# Altium project MSD_FINAL.PrjPcb
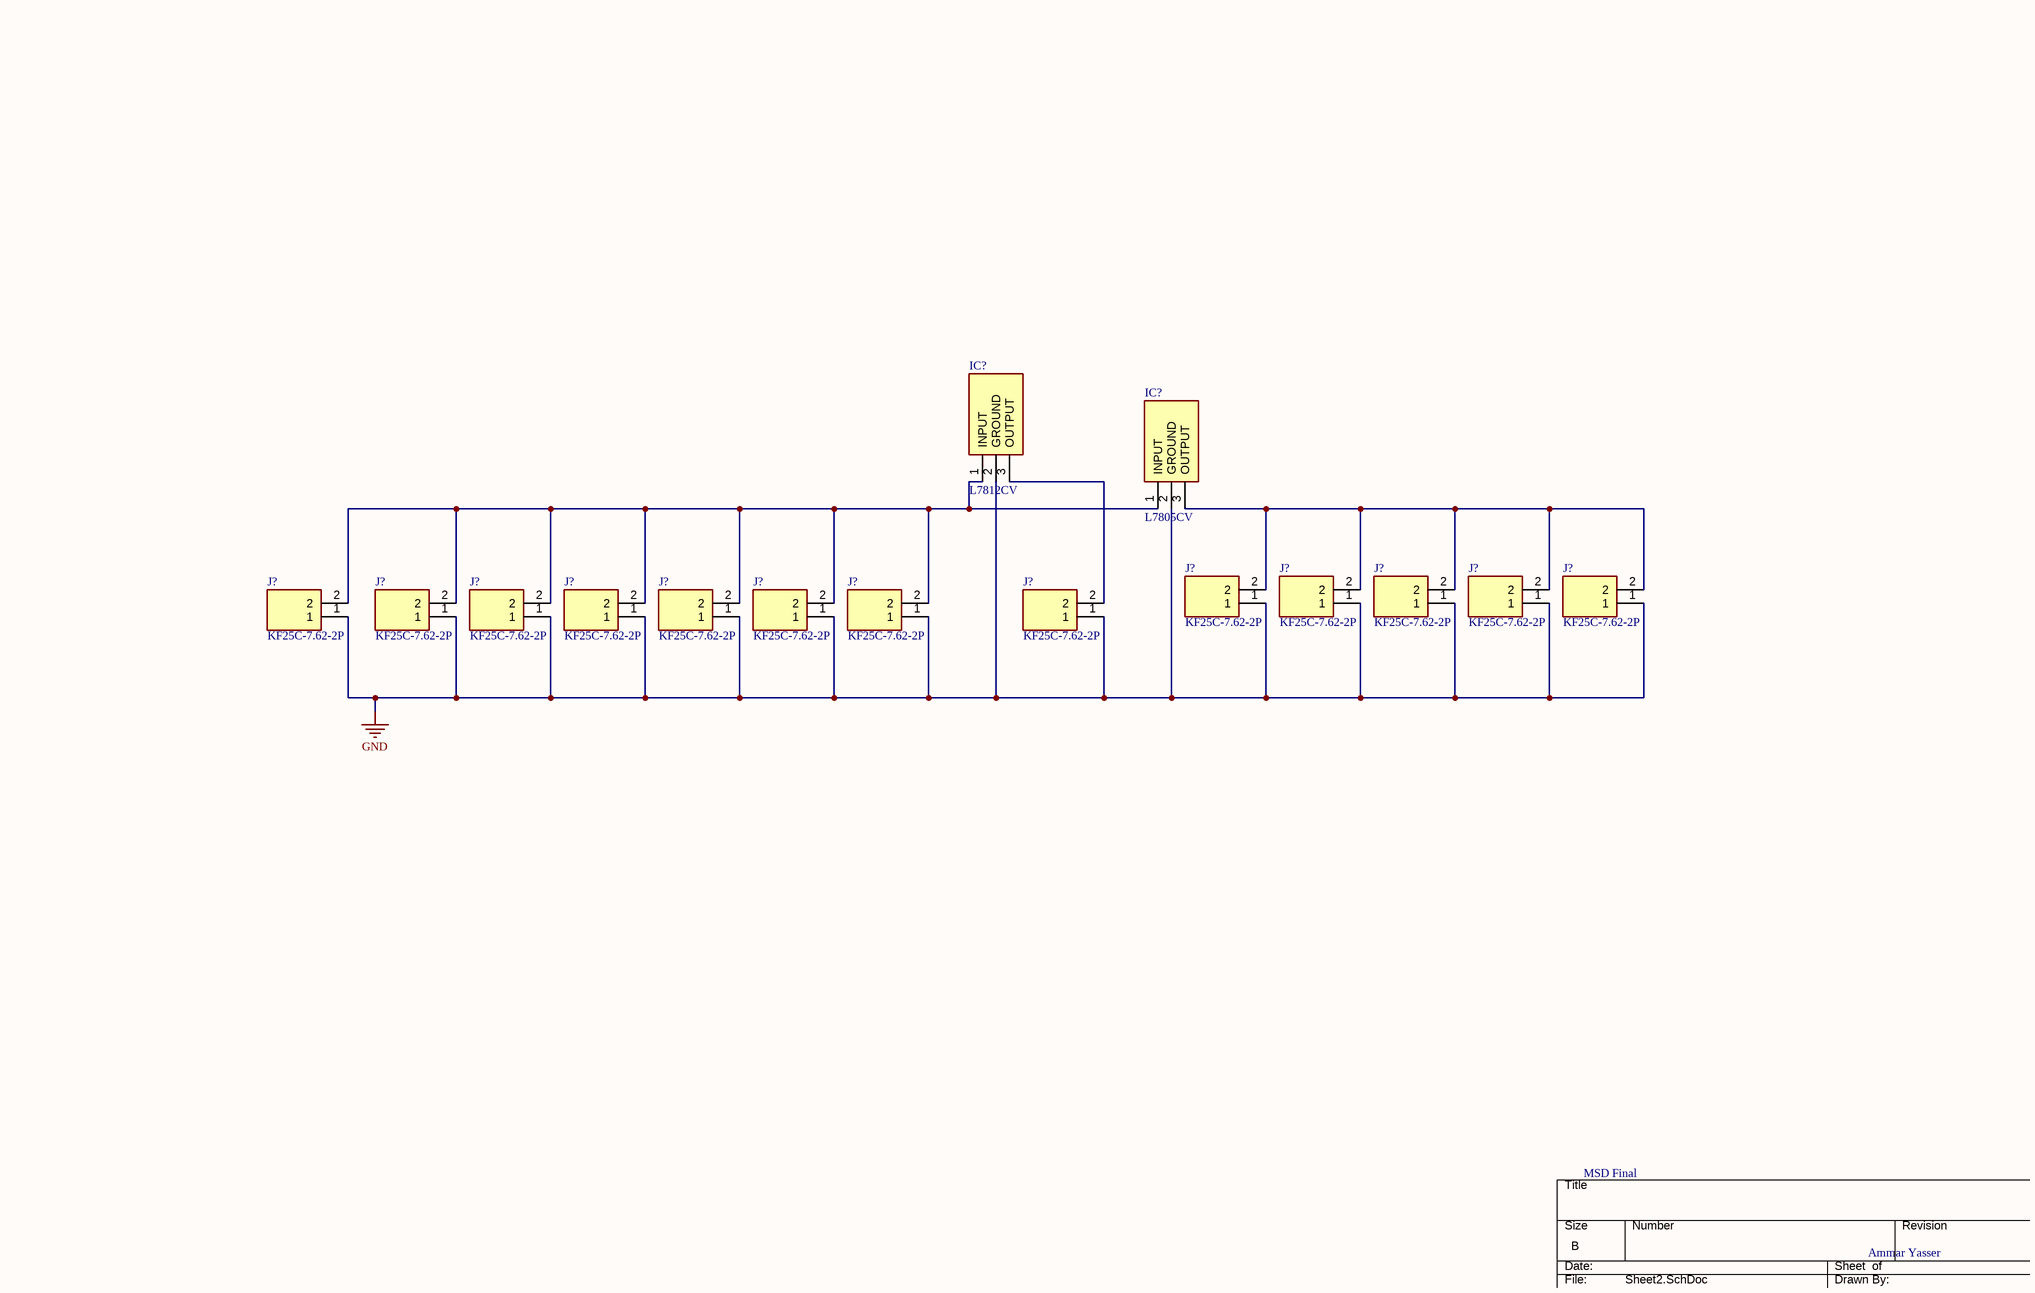
[diagram p0: Sheet2.SchDoc]
1 sheet, 15 parts. Net scope: global (net labels, ports and power ports of the same name join across sheets).
Board file: PCB2.PcbDoc

## Sheet Sheet2.SchDoc
size B; SheetNumber: 1; SheetTotal: 1

### Parts
(Parts that share a designator on the sheet are numbered #1, #2 ... from top to bottom, then left to right.)
IC?#1  L7812CV  [TO255P460X1020X2008-3P]
IC?#2  L7805CV  [TO255P460X1020X2008-3P]
J?#1  KF25C-7.62-2P  [KF25C7622P]
J?#2  KF25C-7.62-2P  [KF25C7622P]
J?#3  KF25C-7.62-2P  [KF25C7622P]
J?#4  KF25C-7.62-2P  [KF25C7622P]
J?#5  KF25C-7.62-2P  [KF25C7622P]
J?#6  KF25C-7.62-2P  [KF25C7622P]
J?#7  KF25C-7.62-2P  [KF25C7622P]
J?#8  KF25C-7.62-2P  [KF25C7622P]
J?#9  KF25C-7.62-2P  [KF25C7622P]
J?#10  KF25C-7.62-2P  [KF25C7622P]
J?#11  KF25C-7.62-2P  [KF25C7622P]
J?#12  KF25C-7.62-2P  [KF25C7622P]
J?#13  KF25C-7.62-2P  [KF25C7622P]

### Nets
GND: IC?#1.2(GROUND) IC?#2.2(GROUND) J?#1.1 J?#2.1 J?#3.1 J?#4.1 J?#5.1 J?#6.1 J?#7.1 J?#8.1 J?#9.1 J?#10.1 J?#11.1 J?#12.1 J?#13.1
NetIC?#1_1: IC?#1.1(INPUT) IC?#2.1(INPUT) J?#6.2 J?#7.2 J?#8.2 J?#9.2 J?#10.2 J?#11.2 J?#12.2
NetIC?#1_3: IC?#1.3(OUTPUT) J?#13.2
NetIC?#2_3: IC?#2.3(OUTPUT) J?#1.2 J?#2.2 J?#3.2 J?#4.2 J?#5.2

### Notes on the sheet
- MSD Final
- Ammar Yasser
- DWG. NO.
- REV.
- SHT.
- THIS DOCUMENT AND THE DATA DISCLOSED HEREIN OR HEREWITH IS THE PROPERTY OF ALTIUM LIMITED AND MAY BE FREELY DISTRIBUTED IN WHOLE. NO RIGHTS ARE RESERVED OR EXPRESS OR IMPLIED WARANTEE GIVEN.
- REVISION
- DESCRIPTION
- DATE
- APPROVED
- ENG:
- APPROVALS
- PROJECT
- DSN:
- CHK:
- REFERENCE DOCUMENTS
- PROJECT REVISION:
- TITLE
- DOCUMENT REVISION:
- DESIGN ITEM:
- BOM:
- FAB DWG:
- PCB DWG:
- ASSY DWG:
- SCALE:
- SIZE
- B
- CAGE CODE
- FILE NAME
- DWG NO.
- SHEET
- OF
- REV

### Library data of the parts
IC?#1 = L7812CV: Integrated Circuit; Manufacturer_Name: STMicroelectronics; Datasheet Link: http://www.st.com/web/en/resource/technical/document/datasheet/CD00000444.pdf; Height: 4.6mm; Manufacturer_Part_Number: L7812CV; Mouser Part Number: 511-L7812CV; Mouser Price/Stock: https://www.mouser.co.uk/ProductDetail/STMicroelectronics/L7812CV?qs=5Uvc6lfWVJzVGZQZmBynyg%3D%3D; Arrow Part Number: L7812CV; Arrow Price/Stock: https://www.arrow.com/en/products/l7812cv/stmicroelectronics?region=europe
IC?#2 = L7805CV: Integrated Circuit; Manufacturer_Name: STMicroelectronics; Datasheet Link: http://www.st.com/web/en/resource/technical/document/datasheet/CD00000444.pdf; Height: 4.6mm; Manufacturer_Part_Number: L7805CV; Mouser Part Number: 511-L7805CV; Mouser Price/Stock: https://www.mouser.co.uk/ProductDetail/STMicroelectronics/L7805CV?qs=9NrABl3fj%2FqplZAHiYUxWg%3D%3D; Arrow Part Number: L7805CV; Arrow Price/Stock: https://www.arrow.com/en/products/l7805cv/stmicroelectronics?region=europe
J?#1-J?#13 = KF25C-7.62-2P: Connector; Manufacturer_Name: KEFA; Datasheet Link: https://datasheet.lcsc.com/lcsc/2007211836_Cixi-Kefa-Elec-KF25C-7-62-2P_C707361.pdf; Height: 14.9mm; Manufacturer_Part_Number: KF25C-7.62-2P